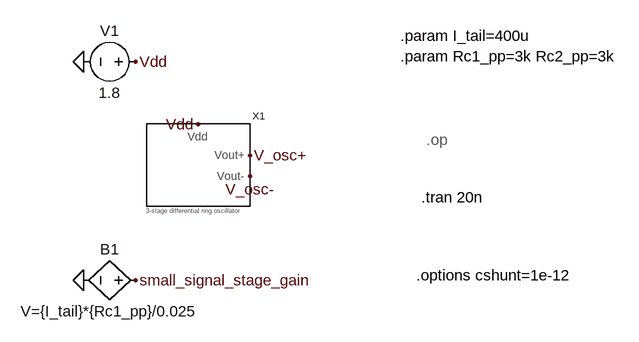
[diagram p0: schematic differential_oscillator_sim.asc]
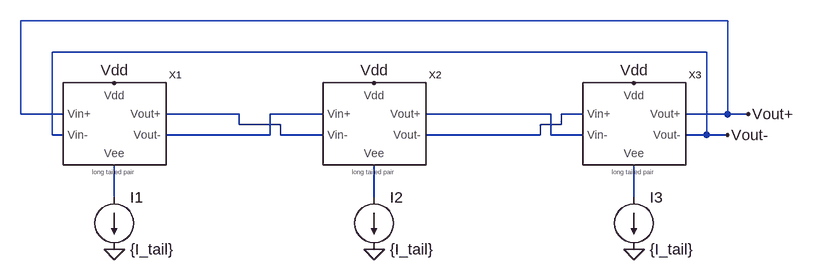
[diagram p1: sub-circuit differential_ring_oscillator_3stage.asc]
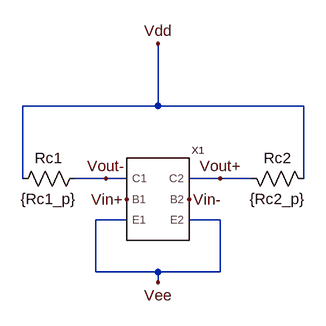
[diagram p2: sub-circuit long_tailed_pair.asc]
differential_oscillator_sim.asc, the LTspice schematic file:
Version 4.1
SHEET 1 1352 680
FLAG 144 48 Vdd
FLAG 224 96 V_osc+
FLAG -32 -48 0
FLAG 48 -48 Vdd
FLAG -32 288 0
FLAG 48 288 small_signal_stage_gain
FLAG 224 128 V_osc-
SYMBOL differential_ring_oscillator_3stage 144 112 R0
SYMATTR InstName X1
SYMBOL voltage 64 -48 R90
WINDOW 0 -32 56 VBottom 2
WINDOW 3 32 56 VTop 2
WINDOW 123 0 0 Left 0
WINDOW 39 0 0 Left 0
SYMATTR InstName V1
SYMATTR Value 1.8
SYMBOL bv 64 288 R90
WINDOW 0 -32 56 VBottom 2
WINDOW 3 32 56 VTop 2
SYMATTR InstName B1
SYMATTR Value V={I_tail}*{Rc1_pp}/0.025
TEXT 456 -88 Left 2 !.param I_tail=400u\n.param Rc1_pp=3k Rc2_pp=3k
TEXT 488 160 Left 2 !.tran 20n
TEXT 496 72 Left 2 ;.op
TEXT 480 280 Left 2 !.options cshunt=1e-12

differential_ring_oscillator_3stage.asc, the sub-circuit schematic file:
Version 4.1
SHEET 1 1468 680
WIRE 1168 -48 80 -48
WIRE 1136 0 128 0
WIRE 80 96 80 -48
WIRE 144 96 80 96
WIRE 416 96 304 96
WIRE 544 96 464 96
WIRE 896 96 704 96
WIRE 944 96 912 96
WIRE 1168 96 1168 -48
WIRE 1168 96 1104 96
WIRE 1200 96 1168 96
WIRE 416 112 416 96
WIRE 480 112 416 112
WIRE 912 112 912 96
WIRE 912 112 880 112
WIRE 128 128 128 0
WIRE 144 128 128 128
WIRE 464 128 464 96
WIRE 464 128 304 128
WIRE 480 128 480 112
WIRE 544 128 480 128
WIRE 880 128 880 112
WIRE 880 128 704 128
WIRE 896 128 896 96
WIRE 944 128 896 128
WIRE 1136 128 1136 0
WIRE 1136 128 1104 128
WIRE 1168 128 1136 128
WIRE 224 224 224 176
WIRE 624 224 624 176
WIRE 1024 224 1024 176
FLAG 224 48 Vdd
FLAG 624 48 Vdd
FLAG 1024 48 Vdd
FLAG 1168 128 Vout-
FLAG 1200 96 Vout+
FLAG 624 304 0
FLAG 1024 304 0
FLAG 224 304 0
SYMBOL long_tailed_pair 224 112 R0
SYMATTR InstName X1
SYMATTR SpiceLine Rc1_p={Rc1_pp} Rc2_p={Rc2_pp}
SYMBOL long_tailed_pair 624 112 R0
SYMATTR InstName X2
SYMATTR SpiceLine Rc1_p={Rc1_pp} Rc2_p={Rc2_pp}
SYMBOL long_tailed_pair 1024 112 R0
SYMATTR InstName X3
SYMATTR SpiceLine Rc1_p={Rc1_pp} Rc2_p={Rc2_pp}
SYMBOL current 224 224 R0
SYMATTR InstName I1
SYMATTR Value {I_tail}
SYMBOL current 624 224 R0
SYMATTR InstName I2
SYMATTR Value {I_tail}
SYMBOL current 1024 224 R0
SYMATTR InstName I3
SYMATTR Value {I_tail}

long_tailed_pair.asc, the sub-circuit schematic file:
Version 4.1
SHEET 1 1140 680
WIRE 208 32 208 -64
WIRE 208 32 0 32
WIRE 432 32 208 32
WIRE 0 144 0 32
WIRE 128 144 80 144
WIRE 160 144 128 144
WIRE 304 144 256 144
WIRE 352 144 304 144
WIRE 432 144 432 32
WIRE 160 208 112 208
WIRE 304 208 256 208
WIRE 112 288 112 208
WIRE 208 288 112 288
WIRE 304 288 304 208
WIRE 304 288 208 288
WIRE 208 304 208 288
FLAG 208 -64 Vdd
FLAG 160 176 Vin+
FLAG 256 176 Vin-
FLAG 208 304 Vee
FLAG 128 144 Vout-
FLAG 304 144 Vout+
SYMBOL res 96 128 R90
WINDOW 0 0 56 VBottom 2
WINDOW 3 32 56 VTop 2
SYMATTR InstName Rc1
SYMATTR Value {Rc1_p}
SYMBOL res 336 128 M90
WINDOW 0 0 56 VBottom 2
WINDOW 3 32 56 VTop 2
SYMATTR InstName Rc2
SYMATTR Value {Rc2_p}
SYMBOL BCM847BS_pair 224 176 R0
SYMATTR InstName X1

The netlist it stands for:
* differential_oscillator_sim.asc
X§X1 Vdd V_osc+ V_osc- differential_ring_oscillator_3stage
V1 Vdd 0 1.8
B1 small_signal_stage_gain 0 V={I_tail}*{Rc1_pp}/0.025

* block symbol definitions
.subckt differential_ring_oscillator_3stage Vdd Vout+ Vout-
X§X1 Vdd Vout+ Vout- N005 N001 N002 long_tailed_pair params: Rc1_p={Rc1_pp} Rc2_p={Rc2_pp}
X§X2 Vdd N002 N001 N006 N003 N004 long_tailed_pair params: Rc1_p={Rc1_pp} Rc2_p={Rc2_pp}
X§X3 Vdd N004 N003 N007 Vout+ Vout- long_tailed_pair params: Rc1_p={Rc1_pp} Rc2_p={Rc2_pp}
I1 N005 0 {I_tail}
I2 N006 0 {I_tail}
I3 N007 0 {I_tail}
.ends differential_ring_oscillator_3stage

.subckt long_tailed_pair Vdd Vin+ Vin- Vee Vout+ Vout-
Rc1 Vout- Vdd {Rc1_p}
Rc2 Vout+ Vdd {Rc2_p}
X§X1 Vout- Vin+ Vee Vout+ Vin- Vee BCM847BS_pair  ; pins C1 B1 E1 C2 B2 E2
.ends long_tailed_pair

.param I_tail=400u
.param Rc1_pp=3k Rc2_pp=3k
.tran 20n
* .op
.options cshunt=1e-12
.backanno
.end